# Altium project MezzDongle.PrjPCB
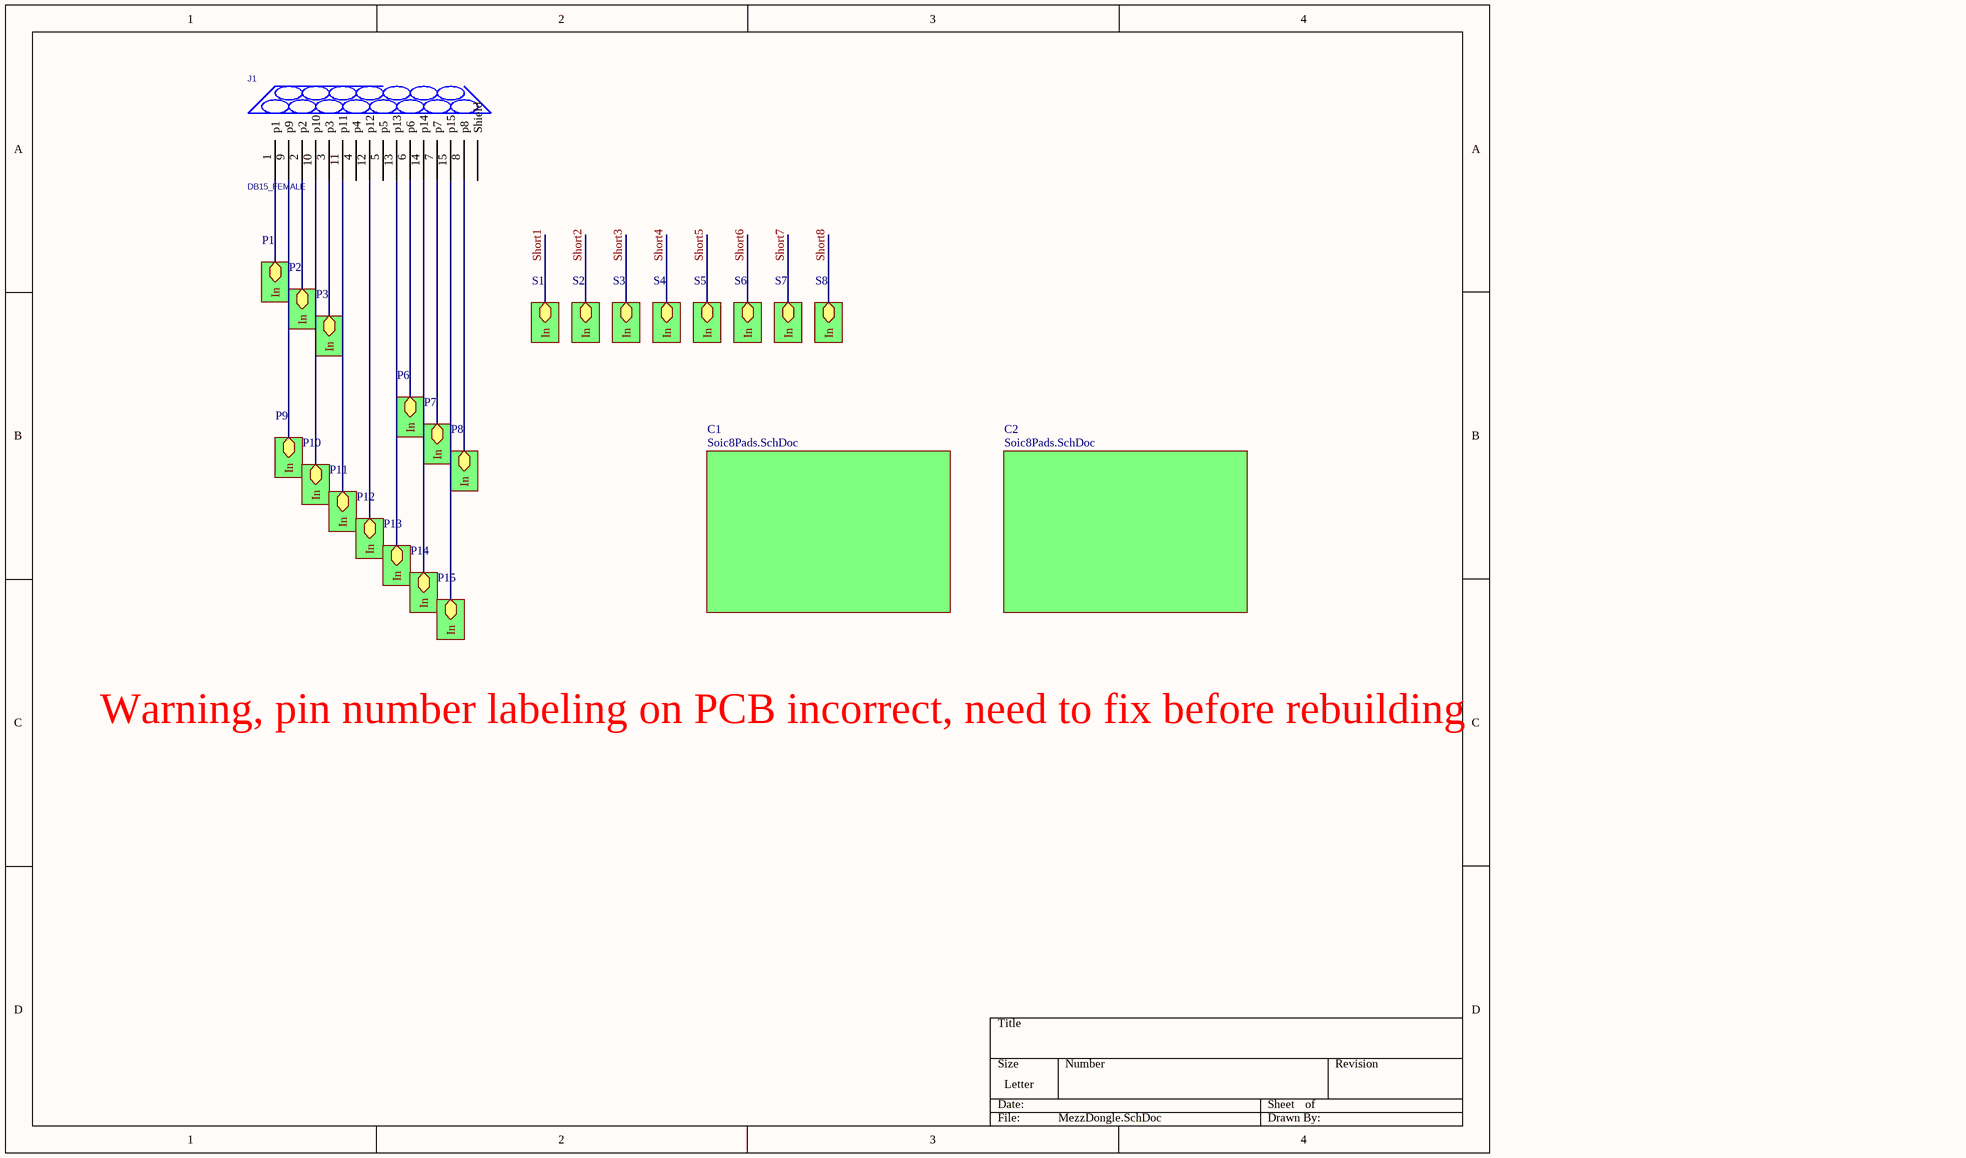
[diagram p0: MezzDongle.SchDoc]
3 sheets, 119 parts. Net scope: hierarchical (ports join the sheet entries above them; power ports are global).
Board files: MezzDongle.PcbDoc, MezzDonglePanel.PcbDoc
Sheets:
  MezzDongle.SchDoc
    P1 = ParallelVias.SchDoc
    P2 = ParallelVias.SchDoc
    P3 = ParallelVias.SchDoc
    P6 = ParallelVias.SchDoc
    P7 = ParallelVias.SchDoc
    P8 = ParallelVias.SchDoc
    P9 = ParallelVias.SchDoc
    P10 = ParallelVias.SchDoc
    P11 = ParallelVias.SchDoc
    P12 = ParallelVias.SchDoc
    P13 = ParallelVias.SchDoc
    P14 = ParallelVias.SchDoc
    P15 = ParallelVias.SchDoc
    S1 = ParallelVias.SchDoc
    S2 = ParallelVias.SchDoc
    S3 = ParallelVias.SchDoc
    S4 = ParallelVias.SchDoc
    S5 = ParallelVias.SchDoc
    S6 = ParallelVias.SchDoc
    C1 = Soic8Pads.SchDoc
    C2 = Soic8Pads.SchDoc
    S7 = ParallelVias.SchDoc
    S8 = ParallelVias.SchDoc

## Sheet MezzDongle.SchDoc
size Letter

### Parts
J1  DB15_FEMALE  [DSUB/RS.318/TM/15]

### Sub-sheets
C1 = Soic8Pads.SchDoc: no entries
C2 = Soic8Pads.SchDoc: no entries
P1 = ParallelVias.SchDoc: In
P2 = ParallelVias.SchDoc: In
P3 = ParallelVias.SchDoc: In
P6 = ParallelVias.SchDoc: In
P7 = ParallelVias.SchDoc: In
P8 = ParallelVias.SchDoc: In
P9 = ParallelVias.SchDoc: In
P10 = ParallelVias.SchDoc: In
P11 = ParallelVias.SchDoc: In
P12 = ParallelVias.SchDoc: In
P13 = ParallelVias.SchDoc: In
P14 = ParallelVias.SchDoc: In
P15 = ParallelVias.SchDoc: In
S1 = ParallelVias.SchDoc: In
S2 = ParallelVias.SchDoc: In
S3 = ParallelVias.SchDoc: In
S4 = ParallelVias.SchDoc: In
S5 = ParallelVias.SchDoc: In
S6 = ParallelVias.SchDoc: In
S7 = ParallelVias.SchDoc: In
S8 = ParallelVias.SchDoc: In

### Nets
NetJ1_1: J1.1(p1) ; sheet P1/In
NetJ1_2: J1.2(p2) ; sheet P2/In
NetJ1_3: J1.3(p3) ; sheet P3/In
NetJ1_6: J1.6(p6) ; sheet P6/In
NetJ1_7: J1.7(p7) ; sheet P7/In
NetJ1_8: J1.8(p8) ; sheet P8/In
NetJ1_9: J1.9(p9) ; sheet P9/In
NetJ1_10: J1.10(p10) ; sheet P10/In
NetJ1_11: J1.11(p11) ; sheet P11/In
NetJ1_12: J1.12(p12) ; sheet P12/In
NetJ1_13: J1.13(p13) ; sheet P13/In
NetJ1_14: J1.14(p14) ; sheet P14/In
NetJ1_15: J1.15(p15) ; sheet P15/In

Not connected (* = marked no-connect by the designer): J1 4(p4) 5(p5) Hole30(Shield)

### Notes on the sheet
- Warning, pin number labeling on PCB incorrect, need to fix before rebuilding

### Library data of the parts
J1 = DB15_FEMALE: COMPFIXED: NO; COMPGROUP: 0; COMPHEIGHT: 0.000; COMPLOC: [4502.733,1338.467]; COMPROT: 270; COMPSIDE: TOP; COMPKEY: NO; COMPLOCKED: NO; DECOUPLER: NO; MEMORY: NO

## Sheet ParallelVias.SchDoc
size Letter
Used 21 times, as channels P1, P2, P3, P6, P7, P8, P9, P10, P11, P12, P13, P14, P15, S1, S2, S3, S4, S5, S6, S7, S8. Parts and nets are listed once, with the designators drawn on the sheet.
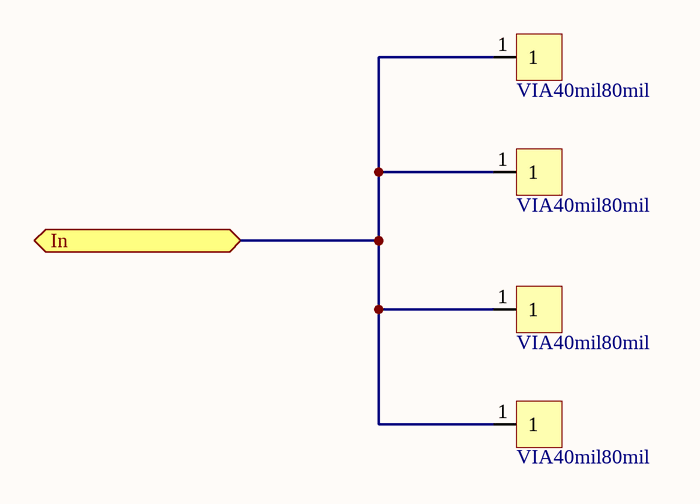
[diagram p1: ParallelVias.SchDoc]

### Parts
V1  VIA40mil80mil  [VIA40mil80mil]
V2  VIA40mil80mil  [VIA40mil80mil]
V3  VIA40mil80mil  [VIA40mil80mil]
V4  VIA40mil80mil  [VIA40mil80mil]

### Ports
In

### Nets
In: V1.1 V2.1 V3.1 V4.1 ; port In

### Channels
P1: designators V1=P1_V1 V2=P1_V2 V3=P1_V3 V4=P1_V4; ports In=NetJ1_1
P2: designators V1=P2_V1 V2=P2_V2 V3=P2_V3 V4=P2_V4; ports In=NetJ1_2
P3: designators V1=P3_V1 V2=P3_V2 V3=P3_V3 V4=P3_V4; ports In=NetJ1_3
P6: designators V1=P6_V1 V2=P6_V2 V3=P6_V3 V4=P6_V4; ports In=NetJ1_6
P7: designators V1=P7_V1 V2=P7_V2 V3=P7_V3 V4=P7_V4; ports In=NetJ1_7
P8: designators V1=P8_V1 V2=P8_V2 V3=P8_V3 V4=P8_V4; ports In=NetJ1_8
P9: designators V1=P9_V1 V2=P9_V2 V3=P9_V3 V4=P9_V4; ports In=NetJ1_9
P10: designators V1=P10_V1 V2=P10_V2 V3=P10_V3 V4=P10_V4; ports In=NetJ1_10
P11: designators V1=P11_V1 V2=P11_V2 V3=P11_V3 V4=P11_V4; ports In=NetJ1_11
P12: designators V1=P12_V1 V2=P12_V2 V3=P12_V3 V4=P12_V4; ports In=NetJ1_12
P13: designators V1=P13_V1 V2=P13_V2 V3=P13_V3 V4=P13_V4; ports In=NetJ1_13
P14: designators V1=P14_V1 V2=P14_V2 V3=P14_V3 V4=P14_V4; ports In=NetJ1_14
P15: designators V1=P15_V1 V2=P15_V2 V3=P15_V3 V4=P15_V4; ports In=NetJ1_15
S1: designators V1=S1_V1 V2=S1_V2 V3=S1_V3 V4=S1_V4; ports In=Short1
S2: designators V1=S2_V1 V2=S2_V2 V3=S2_V3 V4=S2_V4; ports In=Short2
S3: designators V1=S3_V1 V2=S3_V2 V3=S3_V3 V4=S3_V4; ports In=Short3
S4: designators V1=S4_V1 V2=S4_V2 V3=S4_V3 V4=S4_V4; ports In=Short4
S5: designators V1=S5_V1 V2=S5_V2 V3=S5_V3 V4=S5_V4; ports In=Short5
S6: designators V1=S6_V1 V2=S6_V2 V3=S6_V3 V4=S6_V4; ports In=Short6
S7: designators V1=S7_V1 V2=S7_V2 V3=S7_V3 V4=S7_V4; ports In=Short7
S8: designators V1=S8_V1 V2=S8_V2 V3=S8_V3 V4=S8_V4; ports In=Short8

## Sheet Soic8Pads.SchDoc
size Letter
Used 2 times, as channels C1, C2. Parts and nets are listed once, with the designators drawn on the sheet.
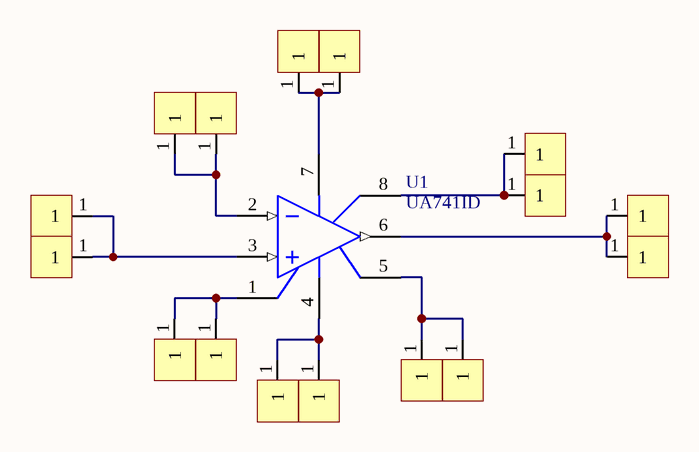
[diagram p2: Soic8Pads.SchDoc]

### Parts
U1  UA741ID  [SO8_N]
V5  VIA40mil80mil  [VIA40mil80mil]  (value not drawn)
V6  VIA40mil80mil  [VIA40mil80mil]  (value not drawn)
V9  VIA40mil80mil  [VIA40mil80mil]  (value not drawn)
V10  VIA40mil80mil  [VIA40mil80mil]  (value not drawn)
V13  VIA40mil80mil  [VIA40mil80mil]  (value not drawn)
V15  VIA40mil80mil  [VIA40mil80mil]  (value not drawn)
V17  VIA40mil80mil  [VIA40mil80mil]  (value not drawn)
V18  VIA40mil80mil  [VIA40mil80mil]  (value not drawn)
V21  VIA40mil80mil  [VIA40mil80mil]  (value not drawn)
V22  VIA40mil80mil  [VIA40mil80mil]  (value not drawn)
V25  VIA40mil80mil  [VIA40mil80mil]  (value not drawn)
V26  VIA40mil80mil  [VIA40mil80mil]  (value not drawn)
V29  VIA40mil80mil  [VIA40mil80mil]  (value not drawn)
V30  VIA40mil80mil  [VIA40mil80mil]  (value not drawn)
V33  VIA40mil80mil  [VIA40mil80mil]  (value not drawn)
V34  VIA40mil80mil  [VIA40mil80mil]  (value not drawn)

### Nets
NetU1_1: U1.1(OS_NULL) V25.1 V26.1
NetU1_2: U1.2(IN-) V9.1 V10.1
NetU1_3: U1.3(IN+) V17.1 V21.1
NetU1_4: U1.4(V-) V33.1 V34.1
NetU1_5: U1.5(OS_NULL) V29.1 V30.1
NetU1_6: U1.6(OUT) V18.1 V22.1
NetU1_7: U1.7(V+) V5.1 V6.1
NetU1_8: U1.8(NC) V13.1 V15.1

### Channels
C1: designators U1=C1_U1 V5=C1_V5 V6=C1_V6 V9=C1_V9 V10=C1_V10 V13=C1_V13 V15=C1_V15 V17=C1_V17 V18=C1_V18 V21=C1_V21 V22=C1_V22 V25=C1_V25 V26=C1_V26 V29=C1_V29 V30=C1_V30 V33=C1_V33 V34=C1_V34
C2: designators U1=C2_U1 V5=C2_V5 V6=C2_V6 V9=C2_V9 V10=C2_V10 V13=C2_V13 V15=C2_V15 V17=C2_V17 V18=C2_V18 V21=C2_V21 V22=C2_V22 V25=C2_V25 V26=C2_V26 V29=C2_V29 V30=C2_V30 V33=C2_V33 V34=C2_V34

### Library data of the parts
U1 = UA741ID: General-Purpose Single Operational Amplifier; Published: 24-Aug-2001; LatestRevisionDate: 13-Apr-2006; LatestRevisionNote: IPC-7351 Footprint Added.; DatasheetVersion: Oct-1997; PackageVersion: Dec-2002; PackageReference: SO8; Publisher: Altium Limited; PackageDescription: 8-Pin Small Outline Integrated Circuit 1.27 mm Pitch; Code_JEDEC: MS-012-AA; Code_IPC: SOIC127P600-8; ComponentLink1Description: Manufacturer Link; ComponentLink1URL: http://www.st.com/; ComponentLink2Description: Datasheet; ComponentLink2URL: http://www.st.com/stonline/products/literature/ds/5304/ua741.pdf

## Nets that join several sheets
NetJ1_1: MezzDongle (J1.1), P1 (P1_V1.1 P1_V2.1 P1_V3.1 P1_V4.1)
NetJ1_2: MezzDongle (J1.2), P2 (P2_V1.1 P2_V2.1 P2_V3.1 P2_V4.1)
NetJ1_3: MezzDongle (J1.3), P3 (P3_V1.1 P3_V2.1 P3_V3.1 P3_V4.1)
NetJ1_6: MezzDongle (J1.6), P6 (P6_V1.1 P6_V2.1 P6_V3.1 P6_V4.1)
NetJ1_7: MezzDongle (J1.7), P7 (P7_V1.1 P7_V2.1 P7_V3.1 P7_V4.1)
NetJ1_8: MezzDongle (J1.8), P8 (P8_V1.1 P8_V2.1 P8_V3.1 P8_V4.1)
NetJ1_9: MezzDongle (J1.9), P9 (P9_V1.1 P9_V2.1 P9_V3.1 P9_V4.1)
NetJ1_10: MezzDongle (J1.10), P10 (P10_V1.1 P10_V2.1 P10_V3.1 P10_V4.1)
NetJ1_11: MezzDongle (J1.11), P11 (P11_V1.1 P11_V2.1 P11_V3.1 P11_V4.1)
NetJ1_12: MezzDongle (J1.12), P12 (P12_V1.1 P12_V2.1 P12_V3.1 P12_V4.1)
NetJ1_13: MezzDongle (J1.13), P13 (P13_V1.1 P13_V2.1 P13_V3.1 P13_V4.1)
NetJ1_14: MezzDongle (J1.14), P14 (P14_V1.1 P14_V2.1 P14_V3.1 P14_V4.1)
NetJ1_15: MezzDongle (J1.15), P15 (P15_V1.1 P15_V2.1 P15_V3.1 P15_V4.1)